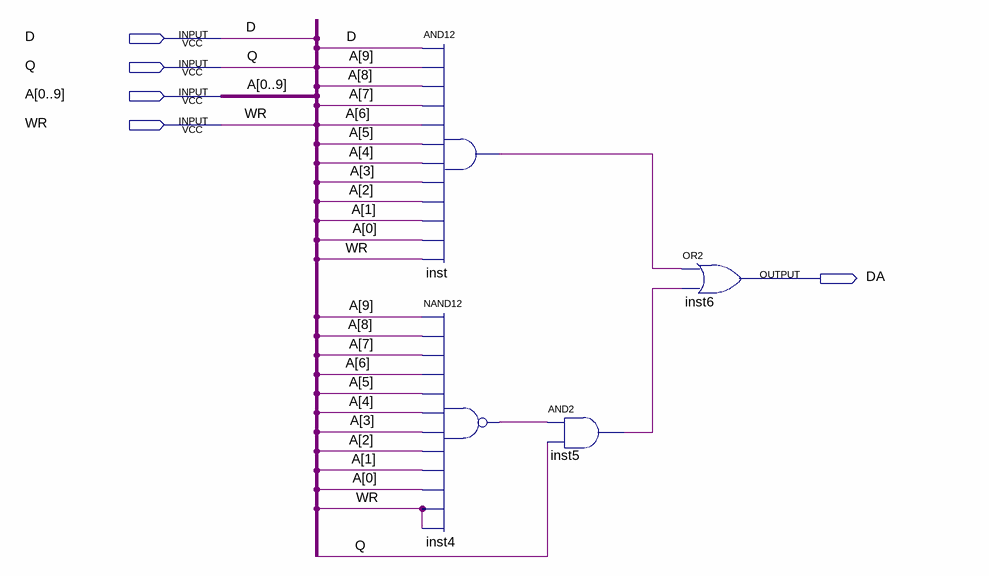
[diagram p0: schematic sheet]
// Quartus schematic Selector.bdf as structural Verilog: 4 symbols, 5 pins
module Selector (
  input  D,
  input  Q,
  input  [0:9] A,
  input  WR,
  output DA
);

  wire inst4_out, inst5_out, inst_out;

  and inst (inst_out, D, A[9], A[8], A[7], A[6], A[5], A[4], A[3], A[2], A[1], A[0], WR);
  nand inst4 (inst4_out, A[9], A[8], A[7], A[6], A[5], A[4], A[3], A[2], A[1], A[0], WR, WR);
  and inst5 (inst5_out, inst4_out, Q);
  or inst6 (DA, inst_out, inst5_out);
endmodule
